# EAGLE design teensy-carrier (EAGLE 8.3.1)

## Sheet 1 of 2
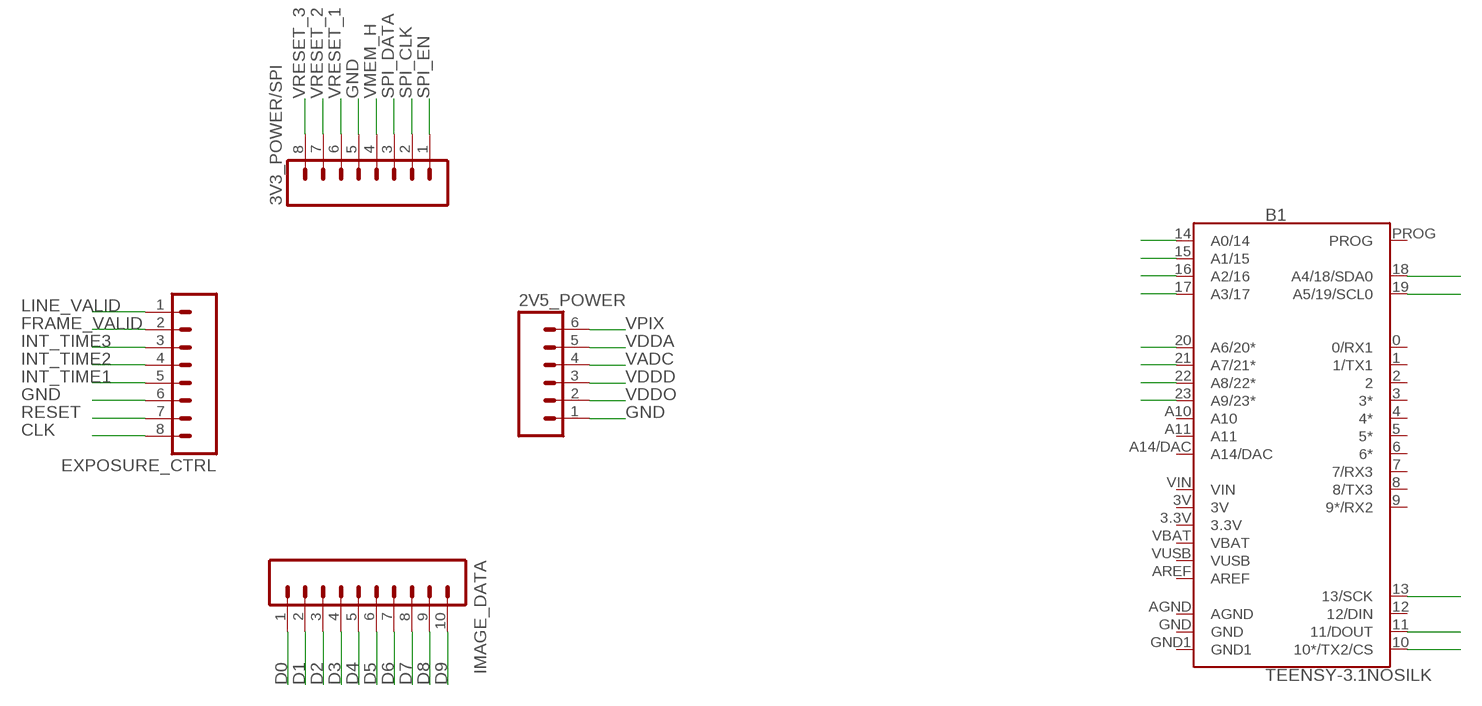
[diagram p0: schematic, sheet 1]

### Parts
2V5_POWER  M06SILK_FEMALE_PTH  [1X06]
3V3_POWER/SPI  M08  [1X08_ROUND]
B1  TEENSY-3.1NOSILK  [TEENSY-3.1_NOSILK]
EXPOSURE_CTRL  M08  [1X08_ROUND]
IMAGE_DATA  M10SILK_FEMALE_PTH  [1X10]

### Nets
CLK: EXPOSURE_CTRL.8
D0: B1.23(A9/23*) IMAGE_DATA.1
D1: B1.22(A8/22*) IMAGE_DATA.2
D2: B1.21(A7/21*) IMAGE_DATA.3
D3: B1.20(A6/20*) IMAGE_DATA.4
D4: B1.19(A5/19/SCL0) IMAGE_DATA.5
D5: B1.18(A4/18/SDA0) IMAGE_DATA.6
D6: B1.17(A3/17) IMAGE_DATA.7
D7: B1.16(A2/16) IMAGE_DATA.8
D8: B1.15(A1/15) IMAGE_DATA.9
D9: B1.14(A0/14) IMAGE_DATA.10
FRAME_VALID: EXPOSURE_CTRL.2
GND: 2V5_POWER.1 3V3_POWER/SPI.5 EXPOSURE_CTRL.6 ; also sheet 2
INT_TIME1: EXPOSURE_CTRL.5
INT_TIME2: EXPOSURE_CTRL.4
INT_TIME3: EXPOSURE_CTRL.3
LINE_VALID: EXPOSURE_CTRL.1
RESET: EXPOSURE_CTRL.7
SPI_CLK: 3V3_POWER/SPI.2 B1.13(13/SCK)
SPI_DATA: 3V3_POWER/SPI.3 B1.11(11/DOUT)
SPI_EN: 3V3_POWER/SPI.1 B1.10(10*/TX2/CS)
VADC: 2V5_POWER.4 ; also sheet 2
VDDA: 2V5_POWER.5 ; also sheet 2
VDDD: 2V5_POWER.3 ; also sheet 2
VDDO: 2V5_POWER.2 ; also sheet 2
VMEM_H: 3V3_POWER/SPI.4 ; also sheet 2
VPIX: 2V5_POWER.6 ; also sheet 2
VRESET_1: 3V3_POWER/SPI.6 ; also sheet 2
VRESET_2: 3V3_POWER/SPI.7
VRESET_3: 3V3_POWER/SPI.8
Unconnected: B1.0(0/RX1) B1.1(1/TX1) B1.2 B1.3(3*) B1.4(4*) B1.5(5*) B1.6(6*) B1.7(7/RX3) B1.8(8/TX3) B1.9(9*/RX2) B1.12(12/DIN) B1.A10 B1.A11 B1.A14/DAC B1.AREF B1.PROG

## Sheet 2 of 2
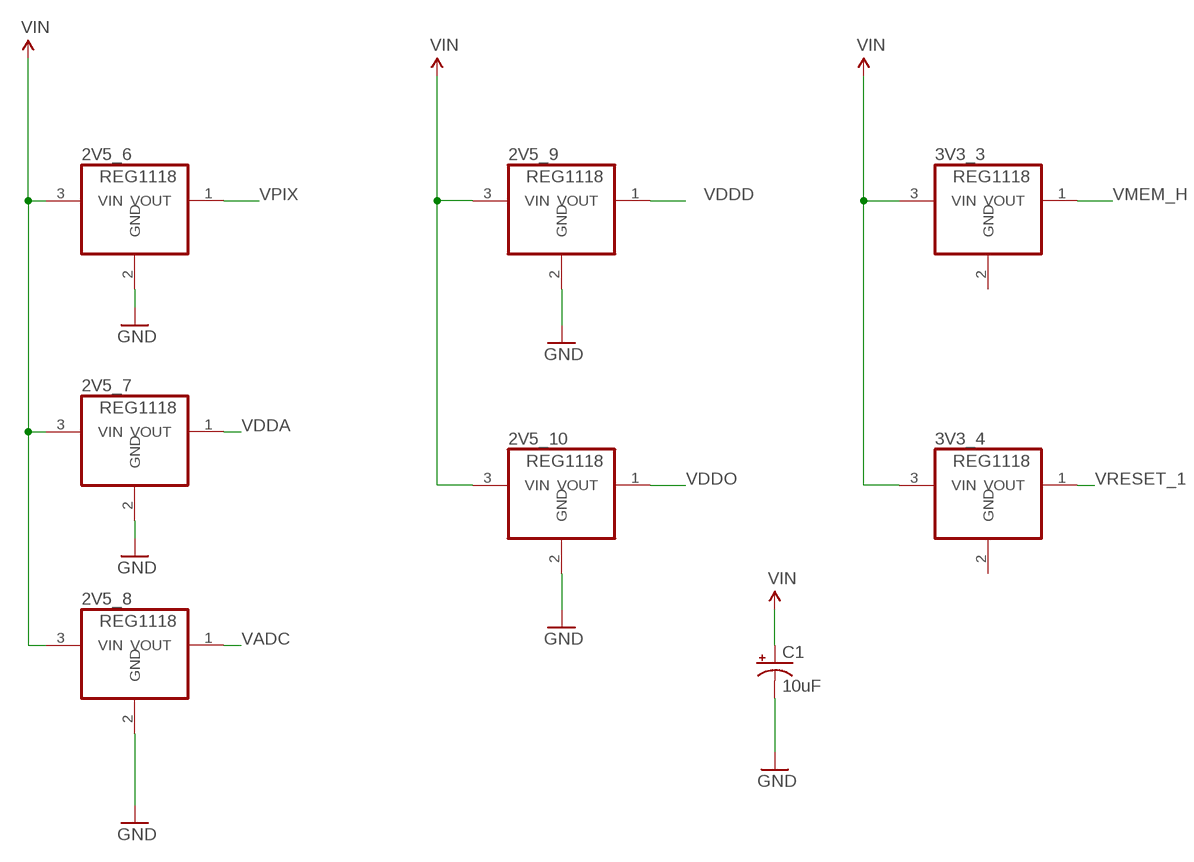
[diagram p1: schematic, sheet 2]

### Parts
2V5_6  REG1118  [SOT223]
2V5_7  REG1118  [SOT223]
2V5_8  REG1118  [SOT223]
2V5_9  REG1118  [SOT223]
2V5_10  REG1118  [SOT223]
3V3_3  REG1118  [SOT223]
3V3_4  REG1118  [SOT223]
C1  10uF  10UF-POLAR-EIA3216-16V-10%(TANT)  [EIA3216]

### Nets
GND: 2V5_6.2(GND) 2V5_7.2(GND) 2V5_8.2(GND) 2V5_9.2(GND) 2V5_10.2(GND) C1.- ; also sheet 1
VADC: 2V5_8.1(VOUT) ; also sheet 1
VDDA: 2V5_7.1(VOUT) ; also sheet 1
VDDD: 2V5_9.1(VOUT) ; also sheet 1
VDDO: 2V5_10.1(VOUT) ; also sheet 1
VIN: 2V5_6.3(VIN) 2V5_7.3(VIN) 2V5_8.3(VIN) 2V5_9.3(VIN) 2V5_10.3(VIN) 3V3_3.3(VIN) 3V3_4.3(VIN) C1.+
VMEM_H: 3V3_3.1(VOUT) ; also sheet 1
VPIX: 2V5_6.1(VOUT) ; also sheet 1
VRESET_1: 3V3_4.1(VOUT) ; also sheet 1

## Power pins joined to a net without a drawn wire
3.3V: B1.3.3V
3V: B1.3V
AGND: B1.AGND
GND: 3V3_3.2(GND) 3V3_4.2(GND) B1.GND
GND1: B1.GND1
VBAT: B1.VBAT
VIN: B1.VIN
VUSB: B1.VUSB

## Library data of the parts
2V5_6-2V5_10 3V3_3 3V3_4 = burr-brown:REG1118: 800mA Low Dropout (LDO) Positive Regulator with Current Source and Sink Capability; MPN: REG1118-2.85/2K5G4; OC_FARNELL: unknown; OC_NEWARK: 14M2185
2V5_POWER = SparkFun-Connectors:M06: Header 6 Standard 6-pin 0.1" header. Use with straight break away headers (SKU : PRT-00116), right angle break away headers (PRT-00553), swiss pins (PRT-00743), machine pins (PRT-00117), and female headers (PRT-00115). Molex polarized connector foot print use with SKU : PRT-08094 with associated crimp pins and housings. NOTES ON THE VARIANTS LOCK and LOCK_LONGPADS... This footprint was designed to help hold the alignment of a through-hole component (i.e. 6-pin header) while soldering it into place. You may notice that each hole has been shifted either up or down by 0.005 of an inch from it's more standard position (which is a perfectly straight line). This slight alteration caused the pins (the squares in the middle) to touch the edges of the holes. Because they are alternating, it causes a "brace" to hold the component in place. 0.005 has proven to be the perfect amount of "off-center" position when using our standard breakaway headers. Although looks a little odd when you look at the bare footprint, once you have a header in there, the alteration is very hard to notice. Also,if you push a header all the way into place, it is covered up entirely on the bottom side. This idea of altering the position of holes to aid alignment will be further integrated into the Sparkfun Library for other footprints. It can help hold any component with 3 or more connection pins.; PROD_ID: CONN-08437
3V3_POWER/SPI EXPOSURE_CTRL = SparkFun-Connectors:M08: Header 8 Standard 8-pin 0.1" header. Use with straight break away headers (SKU : PRT-00116), right angle break away headers (PRT-00553), swiss pins (PRT-00743), machine pins (PRT-00117), and female headers (PRT-00115).; PROD_ID: CONN-08437
B1 = SparkFun-Boards:TEENSY-3.1: Teensy 3+ Footprint Mechanical footprint with connectors for Teensy Development Board with ARM Cortex. SparkFun Products: Teensy 3.2 <https://www.sparkfun.com/products/13736> Teensy LC <https://www.sparkfun.com/products/13305>; SF_ID: DEV-12646
C1 = SparkFun-Capacitors:10UF-POLAR: 10.0µF polarized capacitors A capacitor is a passive two-terminal electrical component used to store electrical energy temporarily in an electric field.; PROD_ID: CAP-00811
IMAGE_DATA = SparkFun-Connectors:M10: Header 10 Standard 10-pin 0.1" header. Use with straight break away headers (SKU : PRT-00116), right angle break away headers (PRT-00553), swiss pins (PRT-00743), machine pins (PRT-00117), and female headers (PRT-00115).; PROD_ID: CONN-11563

## Board
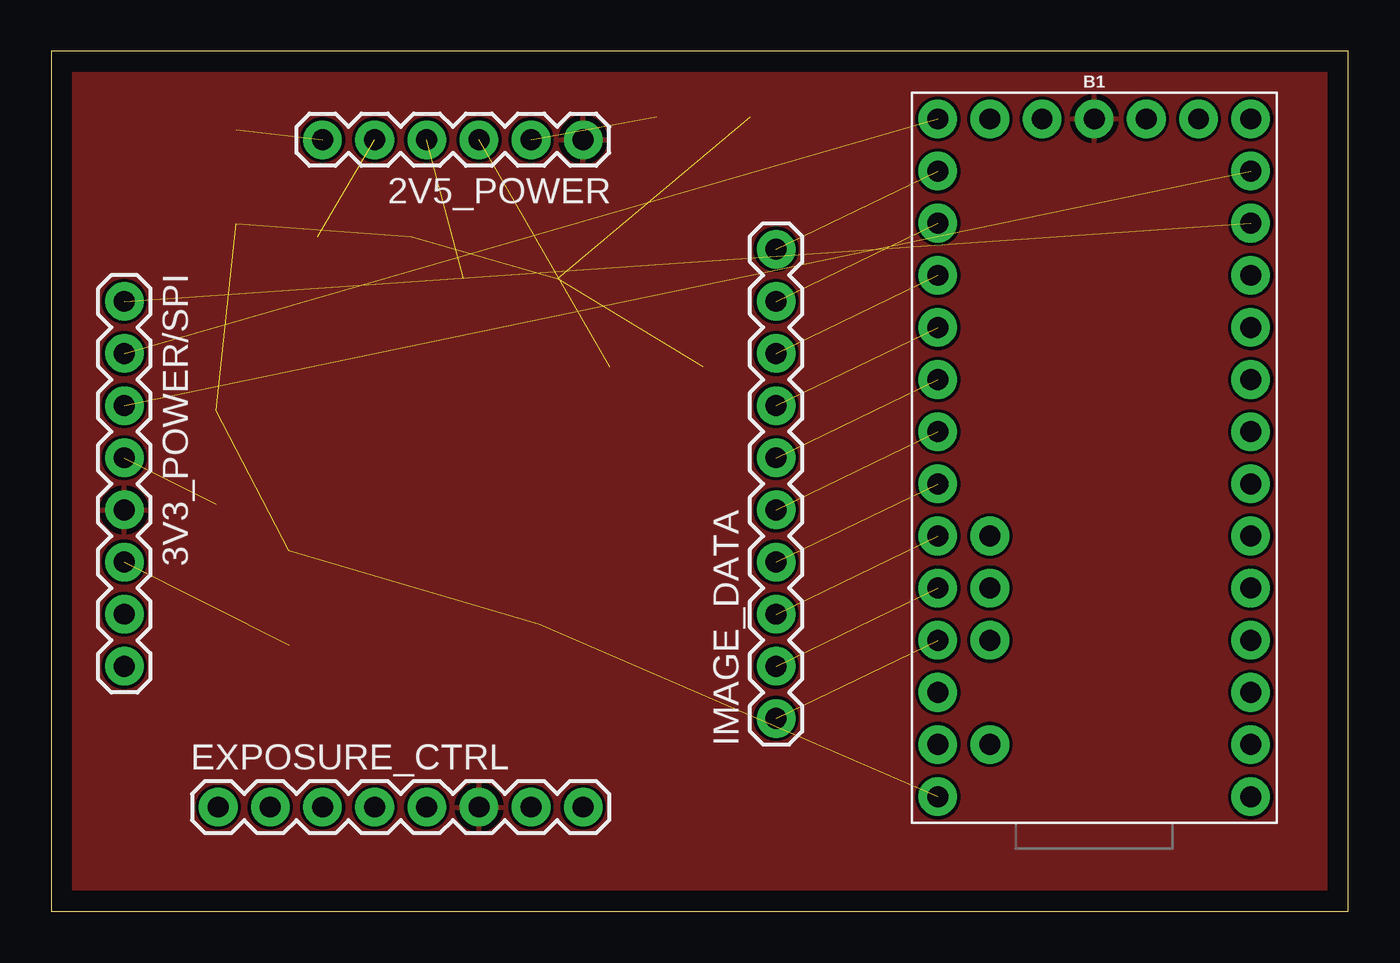
[diagram p2: board, top side]
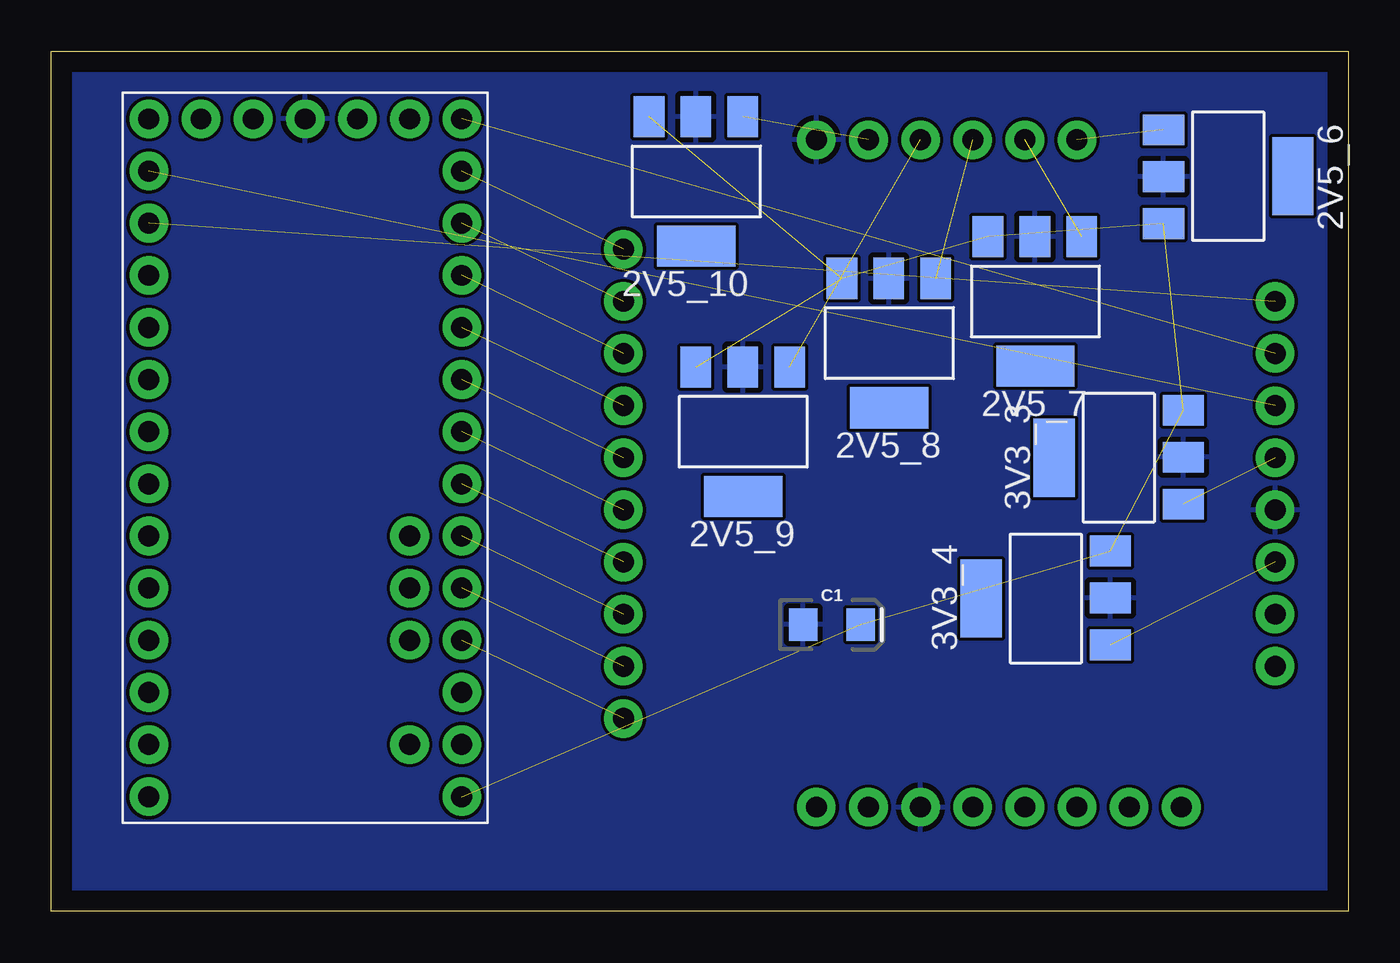
[diagram p3: board, bottom side, seen from below]

Size 63.17 x 41.9 mm. Coordinates in mm from the lower left corner, seen from the top.
Outline: 0,0 63.17,0 63.17,41.9 0,41.9 0,0
Copper layers (1*16): Top 0.035mm / dielectric 1.5mm / Bottom 0.035mm
Design rules "default": minimum track width 6mil, minimum drill 0.35mm, track to track 6mil, track to pad 6mil, pad to pad 6mil, via to via 6mil, smd to smd 6mil, copper to edge 40mil, drill to drill 6mil, minimum pad ring 10mil, minimum via ring 8mil, stop-mask expansion 4mil, vias tented up to drill 0mil, thermal gap 10mil

### Footprints (pad centres in the part's own frame; a part is rotated, then mirrored left to right if it is on the bottom)
SOT223 = smd 1.499 x 2.007: 1 -2.261,-3.15; 2 0.025,-3.15; 3 2.311,-3.15 | smd 3.81 x 2.007: 4 0,3.15
1X06 = drill 1.016 pad 1.88: 1 0,0; 2 2.54,0; 3 5.08,0; 4 7.62,0; 5 10.16,0; 6 12.7,0
1X08_ROUND = drill 1.016 pad 1.88: 1 0,0; 2 2.54,0; 3 5.08,0; 4 7.62,0; 5 10.16,0; 6 12.7,0; 7 15.24,0; 8 17.78,0
TEENSY-3.1_NOSILK = drill 1.016 pad 1.88: 0 7.62,-13.97; 1 7.62,-11.43; 2 7.62,-8.89; 3 7.62,-6.35; 3.3V 2.54,16.51; 3V -7.62,-11.43; 4 7.62,-3.81; 5 7.62,-1.27; 6 7.62,1.27; 7 7.62,3.81; 8 7.62,6.35; 9 7.62,8.89; 10 7.62,11.43; 11 7.62,13.97; 12 7.62,16.51; 13 -7.62,16.51; 14 -7.62,13.97; 15 -7.62,11.43; 16 -7.62,8.89; 17 -7.62,6.35; 18 -7.62,3.81; 19 -7.62,1.27; 20 -7.62,-1.27; 21 -7.62,-3.81; 22 -7.62,-6.35; 23 -7.62,-8.89; A10 -5.08,-6.35; A11 -5.08,-3.81; A14/DAC -5.08,16.51; AGND -7.62,-13.97; AREF -5.08,-8.89; GND 0,16.51; GND1 7.62,-16.51; PROG -2.54,16.51; VBAT 5.08,16.51; VIN -7.62,-16.51; VUSB -5.08,-13.97
EIA3216 = smd 1.4 x 1.6: + 1.4,0; - -1.4,0
1X10 = drill 1.016 pad 1.88: 1 0,0; 2 2.54,0; 3 5.08,0; 4 7.62,0; 5 10.16,0; 6 12.7,0; 7 15.24,0; 8 17.78,0; 9 20.32,0; 10 22.86,0

### Placement (x,y rotation side)
2V5_6  5.84,35.81 270 bottom
2V5_7  15.24,29.72 180 bottom
2V5_8  22.35,27.69 180 bottom
2V5_9  29.46,23.37 180 bottom
2V5_10  31.75,35.56 180 bottom
2V5_POWER  25.91,37.59 180 top
3V3_3  11.18,22.1 90 bottom
3V3_4  14.73,15.24 90 bottom
3V3_POWER/SPI  3.56,29.72 270 top
B1  50.8,22.1 0 top
C1  25.15,13.97 0 bottom
EXPOSURE_CTRL  8.13,5.08 0 top
IMAGE_DATA  35.31,9.4 90 top

### Tracks (layer width: path | path; a pad name or v marks a point on that pad's centre or on a via)
D0  (1 unrouted)
D1  (1 unrouted)
D2  (1 unrouted)
D3  (1 unrouted)
D4  (1 unrouted)
D5  (1 unrouted)
D6  (1 unrouted)
D7  (1 unrouted)
D8  (1 unrouted)
D9  (1 unrouted)
GND
  pour Top: 0,41.66 63.25,41.66 63.25,0 0,0
  pour Bottom: 0,41.66 63.25,41.66 63.25,0 0,0
SPI_CLK  (1 unrouted)
SPI_DATA  (1 unrouted)
SPI_EN  (1 unrouted)
VADC  (1 unrouted)
VDDA  (1 unrouted)
VDDD  (1 unrouted)
VDDO  (1 unrouted)
VIN  (8 unrouted)
VMEM_H  (1 unrouted)
VPIX  (1 unrouted)
VRESET_1  (1 unrouted)